# Altium project BackPCB.PrjPcb
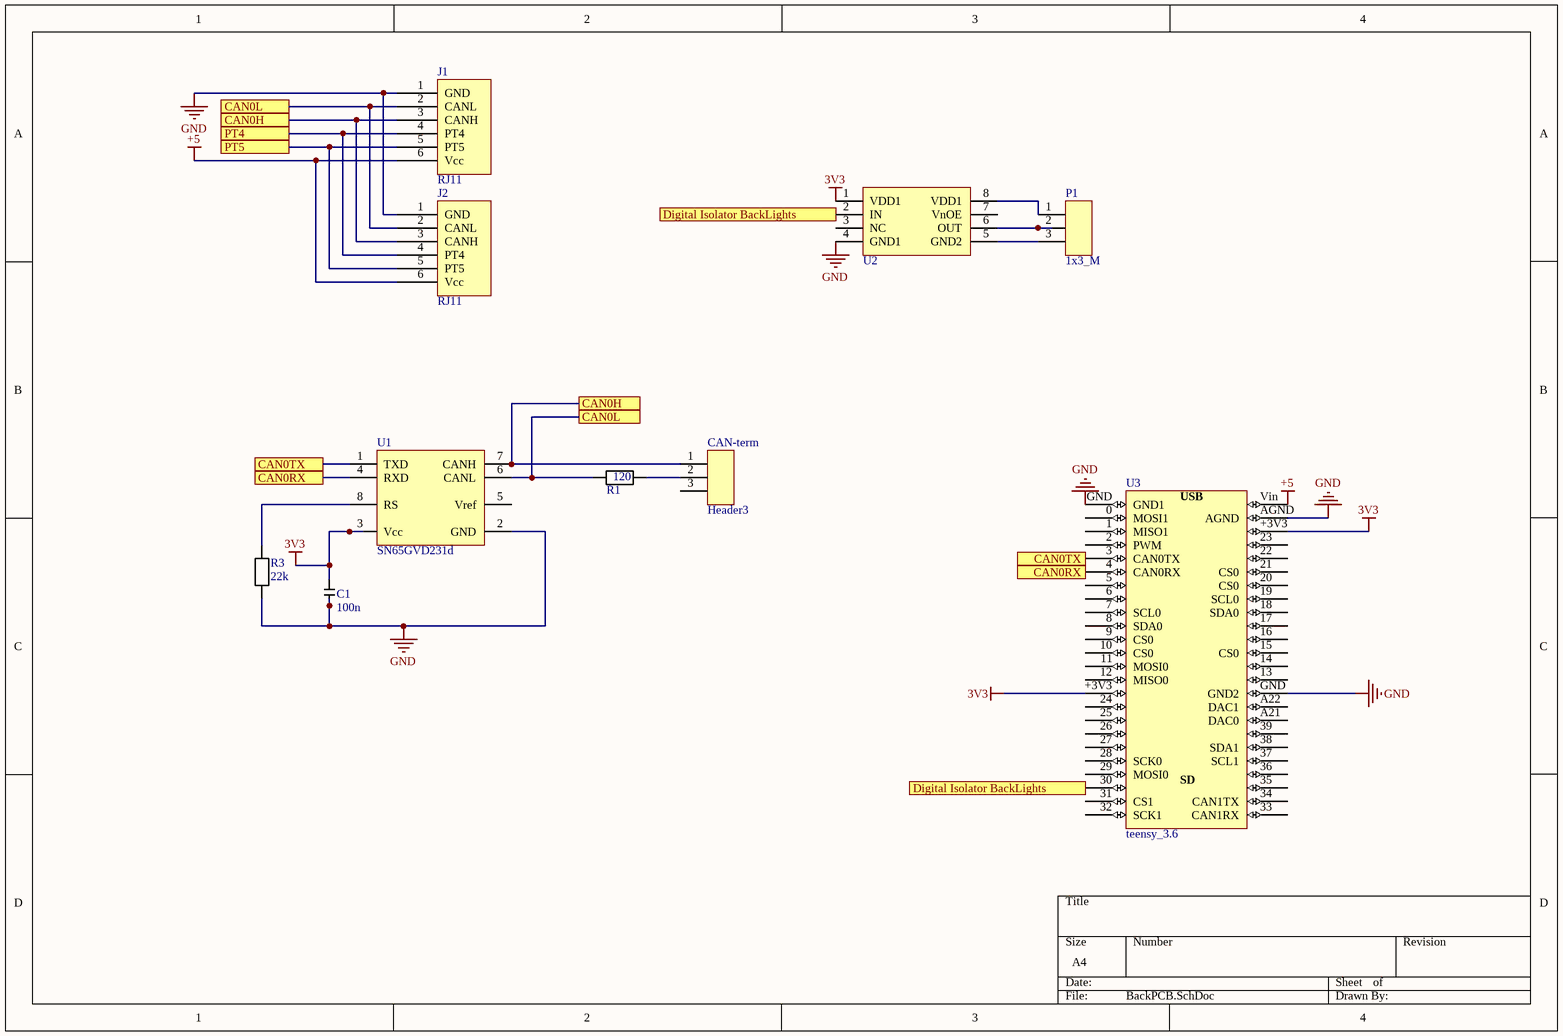
[diagram p0: BackPCB.SchDoc]
1 sheet, 10 parts. Net scope: flat (ports and power ports of the same name join across sheets).
Board file: BackPCB.PcbDoc

## Sheet BackPCB.SchDoc
size A4

### Parts
C1  value 100n  [C_SMD_0805_pcb]  (hidden comment: SMD)
CAN-term  Header3  [PIN_HEADER_M_1x3]
J1  RJ11  [RJ11_Connector]
J2  RJ11  [RJ11_Connector]
P1  1x3_M  [PIN_HEADER_M_1x3]
R1  value 120  [R_SMD_0805_pcb]  (hidden comment: SMD)
R3  value 22k  [R_SMD_0805_pcb]  (hidden comment: SMD)
U1  SN65GVD231d  [SN65HVD231D_SMD]
U2  IL_710-2E_DIGITAL_ISOLATOR  [IL_710-2E_DIP8]  (value not drawn)
U3  teensy_3.6  [teensy_3.6]

### Ports
CAN0H, CAN0L, CAN0RX, CAN0TX, Digital Isolator BackLights, PT4, PT5

### Nets
3V3: C1.1 U1.3(Vcc) U2.1(VDD1) U3.+3V3
+5: J1.6(Vcc) J2.6(Vcc) U3.Vin
GND: C1.2 J1.1(GND) J2.1(GND) R3.1 U1.2(GND) U2.4(GND1) U3.AGND U3.GND(GND1)
NetCAN-term_1: CAN-term.1 J1.3(CANH) J2.3(CANH) U1.7(CANH) ; port CAN0H
NetCAN-term_2: CAN-term.2 R1.2
NetJ1_2: J1.2(CANL) J2.2(CANL) R1.1 U1.6(CANL) ; port CAN0L
NetJ1_4: J1.4(PT4) J2.4(PT4) ; port PT4
NetJ1_5: J1.5(PT5) J2.5(PT5) ; port PT5
NetP1_1: P1.1 U2.8(VDD1)
NetP1_2: P1.2 U2.6(OUT)
NetP1_3: P1.3 U2.5(GND2)
NetR3_2: R3.2 U1.8(RS)
NetU1_1: U1.1(TXD) U3.3(CAN0TX) ; port CAN0TX
NetU1_4: U1.4(RXD) U3.4(CAN0RX) ; port CAN0RX
NetU2_2: U2.2(IN) U3.30 ; port Digital Isolator BackLights

Not connected (* = marked no-connect by the designer): CAN-term 3; U1 5(Vref); U2 3(NC) 7(VnOE); U3 0(MOSI1) 1(MISO1) 2(PWM) 5 6 7(SCL0) 8(SDA0) 9(CS0) 10(CS0) 11(MOSI0) 12(MISO0) 13 14 15(CS0) 16 17 18(SDA0) 19(SCL0) 20(CS0) 21(CS0) 22 23 24 25 26 27 28(SCK0) 29(MOSI0) 31(CS1) 32(SCK1) 33(CAN1RX) 34(CAN1TX) 35 36 37(SCL1) 38(SDA1) 39 A21(DAC0) A22(DAC1)

### Notes on the sheet
- (in symbol teensy_3.6) USB; SD

### Library data of the parts
C1 = C_SMD_0805: Supplier 1: *; Supplier Part Number 1: *
CAN-term P1 = PIN_HEADER_M_1x3
  P1: Supplier 1: *; Supplier Part Number 1: *
J1 J2 = RJ11_Connector: Supplier Part Number 1: *; Supplier 1: *
R1 R3 = R_SMD_0805: Supplier 1: *; Supplier Part Number 1: *
U1 = SN65HVD231D_SMD: Supplier 1: *; Supplier Part Number 1: *
U2 = IL_710-2E_DIGITAL_ISOLATOR: Digital Isolator 3-5V input/output.; Supplier Part Number 1: *; Supplier 1: *